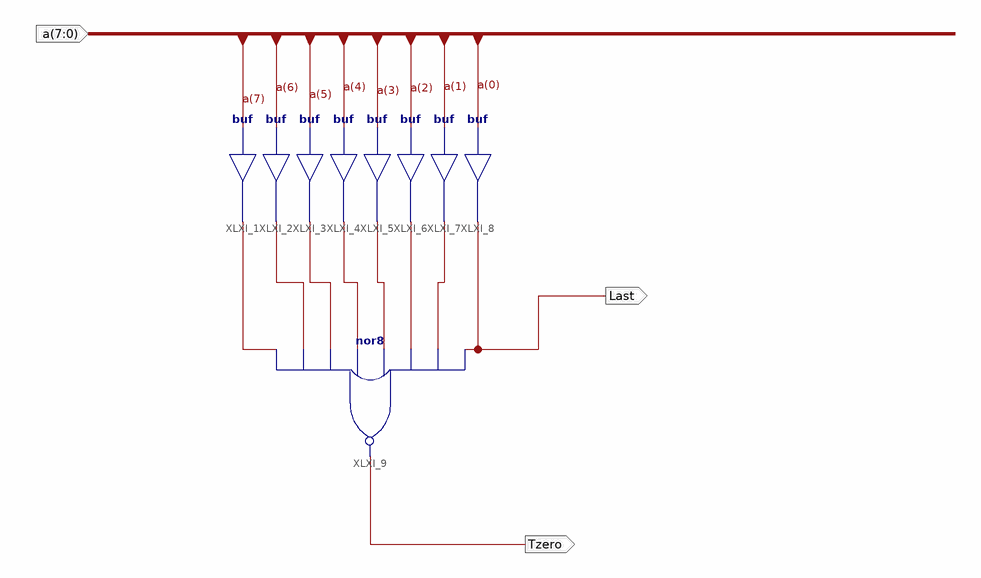
[diagram p0: schematic sheet 1]
// Xilinx ISE schematic IsZero.sch (spartan3a) as structural Verilog: 9 symbols, 3 ports
module IsZero (
  input  [7:0] a,
  output Tzero,
  output Last
);

  wire XLXN_16, XLXN_17, XLXN_18, XLXN_19, XLXN_20, XLXN_21, XLXN_22;

  buf XLXI_1 (XLXN_16, a[7]);
  buf XLXI_2 (XLXN_17, a[6]);
  buf XLXI_3 (XLXN_18, a[5]);
  buf XLXI_4 (XLXN_19, a[4]);
  buf XLXI_5 (XLXN_20, a[3]);
  buf XLXI_6 (XLXN_21, a[2]);
  buf XLXI_7 (XLXN_22, a[1]);
  buf XLXI_8 (Last, a[0]);
  nor XLXI_9 (Tzero, XLXN_16, XLXN_17, XLXN_18, XLXN_19, XLXN_20, XLXN_21, XLXN_22, Last);
endmodule
